# EAGLE design emonGLCD_V1.3 (EAGLE 5.11)
ABBREV: tx1; DRAWING_AUTHOR: Glyn Husdson; PROJECT: EmonTx V1.0
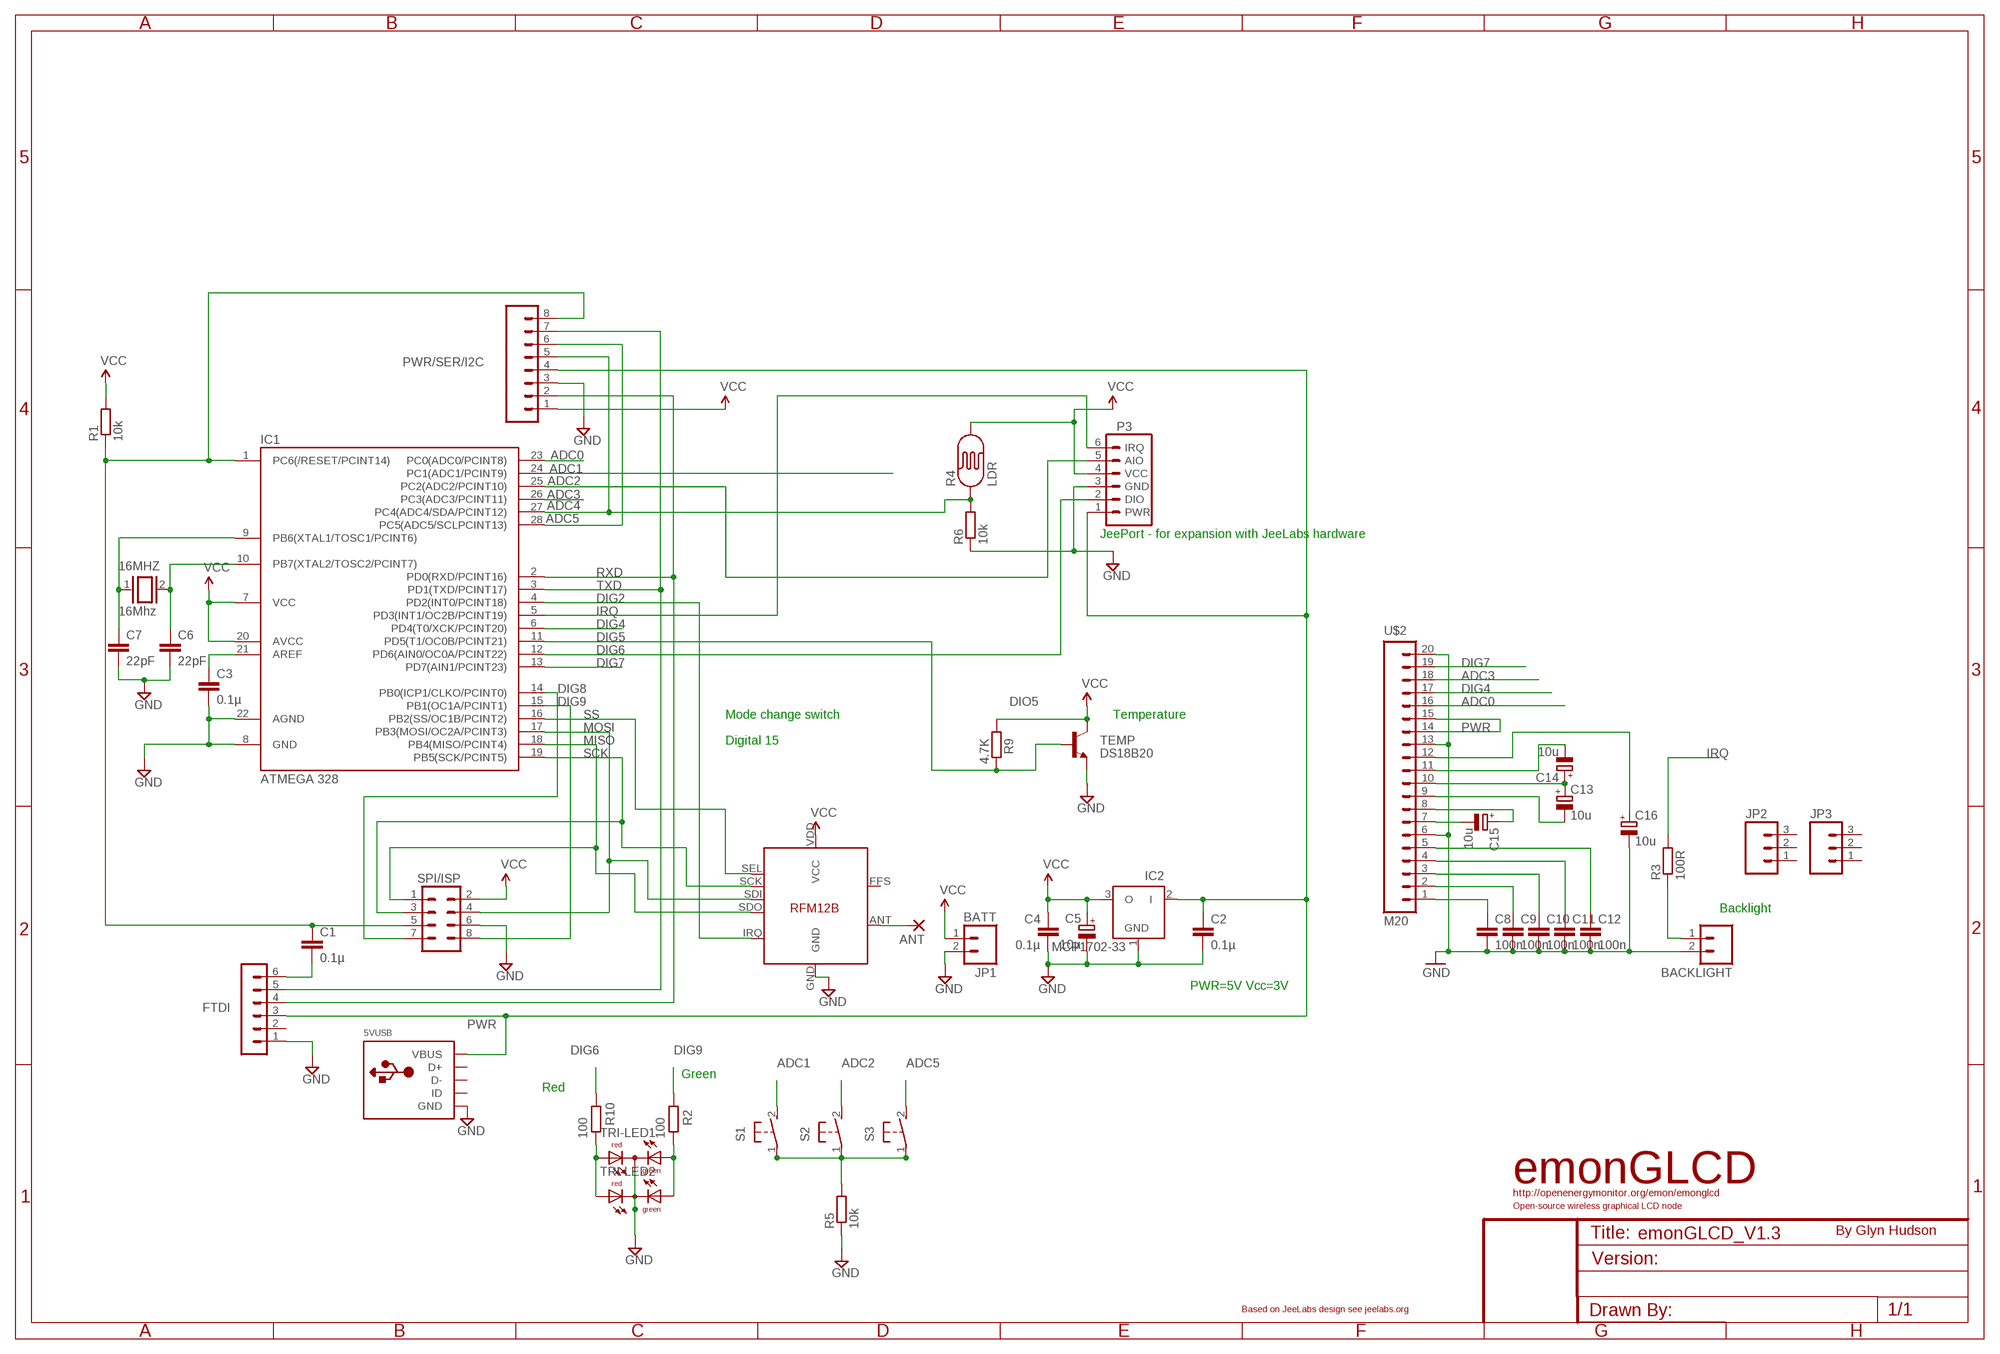
[diagram p0: schematic, sheet 1]

## Parts
5VUSB  USBMOLEX  [USB-MINIB-THM-MOLEX]
16MHZ  16Mhz  XTAL/S  [QS]
ANT  1,6/0,8  [1,6/0,8]
BACKLIGHT  M02PTH  [1X02]
C1  0.1µ  C-EU025-024X044  [C025-024X044]
C2  0.1µ  C-EU025-024X044  [C025-024X044]
C3  0.1µ  C-EU025-024X044  [C025-024X044]
C4  0.1µ  C-EU025-024X044  [C025-024X044]
C5  10µ  CPOL-EUE1.8-4  [E1,8-4]
C6  22pF  C2.5/2  [C2.5-2]
C7  22pF  C2.5/2  [C2.5-2]
C8  100n  C2.5/2  [C2.5-2]
C9  100n  C2.5/2  [C2.5-2]
C10  100n  C2.5/2  [C2.5-2]
C11  100n  C2.5/2  [C2.5-2]
C12  100n  C2.5/2  [C2.5-2]
C13  10u  CPOL-EUE1.8-4  [E1,8-4]
C14  10u  CPOL-EUE1.8-4  [E1,8-4]
C15  10u  CPOL-EUE1.8-4  [E1,8-4]
C16  10u  CPOL-EUE1.8-4  [E1,8-4]
FTDI  FTDI  MA06-1  [MA06-1]
IC1  ATMEGA 328  ATMEGA48/88/168-PU  [DIL28-3]
IC2  MCP1702-33  MCP1702Z  [TO92]
JP1  BATT  M02LOCK_LONGPADS  [1X02_LOCK_LONGPADS]
JP2  M03PTH  [1X03]
JP3  M03PTH  [1X03]
P3  JEEPORT  JEEPORT-LONGPADS  [PORT6PIN]
PWR/SER/I2C  M08  [1X08]
R1  10k  R-EU_0204/7  [0204/7]
R2  100  R-EU_0204/7  [0204/7]
R3  100R  R-EU_0204/7  [0204/7]
R4  LDR  PHOTOCELLPTH  [PHOTOCELL]
R5  10k  R-EU_0204/7  [0204/7]
R6  10k  R-EU_0204/7  [0204/7]
R9  4.7K  R-EU_0204/7  [0204/7]
R10  100  R-EU_0204/7  [0204/7]
S1  31-XX  [B3F-31XX]
S2  31-XX  [B3F-31XX]
S3  31-XX  [B3F-31XX]
SV7  SPI/ISP  MA04-2  [MA04-2]
TEMP  DS18B20  TRANSISTOR_NPNTO92  [TO-92]
TRI-LED1  DUOLED5MM  [DUOLED5MM]
TRI-LED2  DUOLED5MM  [DUOLED5MM]
U$1  RFM12B  [RFM12B]
U$2  M20  [1X20]

## Nets
ADC0: IC1.23(PC0(ADC0/PCINT8)) U$2.16
ADC1: IC1.24(PC1(ADC1/PCINT9)) S1.2(S)
ADC2: IC1.25(PC2(ADC2/PCINT10)) P3.5(AIO) S2.2(S)
ADC3: IC1.26(PC3(ADC3/PCINT11)) U$2.18
ADC4: IC1.27(PC4(ADC4/SDA/PCINT12)) PWR/SER/I2C.5 R4.1 R6.2
ADC5: IC1.28(PC5(ADC5/SCLPCINT13)) PWR/SER/I2C.6 S3.2(S)
DIG2: IC1.4(PD2(INT0/PCINT18)) U$1.IRQ
DIG4 [power]: IC1.6(PD4(T0/XCK/PCINT20)) U$2.17
DIG5: IC1.11(PD5(T1/OC0B/PCINT21)) R9.2 TEMP.2(B)
DIG6: IC1.12(PD6(AIN0/OC0A/PCINT22)) P3.2(DIO) R10.2
DIG7: IC1.13(PD7(AIN1/PCINT23)) U$2.19
DIG8: IC1.14(PB0(ICP1/CLKO/PCINT0)) SV7.7
DIG9: IC1.15(PB1(OC1A/PCINT1)) R2.2 SV7.8
GND [power]: 5VUSB.GND BACKLIGHT.2 C2.2 C3.2 C4.2 C5.- C6.2 C7.2 C8.2 C9.2 C10.2 C11.2 C12.2 C16.- FTDI.1 IC1.8(GND) IC1.22(AGND) IC2.1(GND) JP1.2 P3.3(GND) PWR/SER/I2C.3 R5.1 R6.1 SV7.6 TEMP.1(E) TRI-LED1.K(C) TRI-LED2.K(C) U$1.GND U$2.6 U$2.13 U$2.20
IRQ: IC1.5(PD3(INT1/OC2B/PCINT19)) P3.6(IRQ) R3.2
MISO: IC1.18(PB4(MISO/PCINT4)) SV7.1 U$1.SDO
MOSI: IC1.17(PB3(MOSI/OC2A/PCINT3)) SV7.4 U$1.SDI
N$1: 16MHZ.2 C6.1 IC1.10(PB7(XTAL2/TOSC2/PCINT7))
N$2: C8.1 U$2.1
N$3: C9.1 U$2.2
N$4: R5.2 S1.1(P) S2.1(P) S3.1(P)
N$5: C10.1 U$2.3
N$6: C11.1 U$2.4
N$7: C12.1 U$2.5
N$8: R10.1 TRI-LED1.AR TRI-LED2.AR
N$12: 16MHZ.1 C7.1 IC1.9(PB6(XTAL1/TOSC1/PCINT6))
N$13: ANT.1(P) U$1.ANT
N$14: R2.1 TRI-LED1.AG TRI-LED2.AG
N$15: C1.2 FTDI.6
N$17: BACKLIGHT.1 R3.1
N$19: C3.1 IC1.21(AREF)
N$20: C14.- U$2.11
N$21: C13.+ C14.+ U$2.10
N$22: C13.- U$2.9
N$23: C15.- U$2.7
N$27: C15.+ U$2.8
N$28: C16.+ U$2.12
PWR [power]: 5VUSB.VBUS C2.1 FTDI.3 IC2.2(I) P3.1(PWR) PWR/SER/I2C.4 U$2.14 U$2.15
RST: C1.1 IC1.1(PC6(/RESET/PCINT14)) PWR/SER/I2C.8 R1.1 SV7.5
RXD: FTDI.4 IC1.2(PD0(RXD/PCINT16)) PWR/SER/I2C.2
SCK: IC1.19(PB5(SCK/PCINT5)) SV7.3 U$1.SCK
SS: IC1.16(PB2(SS/OC1B/PCINT2)) U$1.SEL
TXD: FTDI.5 IC1.3(PD1(TXD/PCINT17)) PWR/SER/I2C.7
VCC [power]: C4.1 C5.+ IC1.7(VCC) IC1.20(AVCC) IC2.3(O) JP1.1 P3.4(VCC) PWR/SER/I2C.1 R1.2 R4.2 R9.1 SV7.2 TEMP.3(C) U$1.VDD(VCC)
Unconnected: 5VUSB.D+ 5VUSB.D- 5VUSB.ID FTDI.2 JP2.1 JP2.2 JP2.3 JP3.1 JP3.2 JP3.3 U$1.FFS

## Notes on the sheet
- JeePort - for expansion with JeeLabs hardware
- DIO5
- Mode change switch | Temperature
- Digital 15
- Backlight
- PWR=5V Vcc=3V
- Green
- Red
- emonGLCD
- http://openenergymonitor.org/emon/emonglcd
- Open-source wireless graphical LCD node
- By Glyn Hudson
- Based on JeeLabs design see jeelabs.org

## Library data of the parts
5VUSB = adafruit:USB: USB Connectors USBMINIB - Surface Mount Female Mini-B USB Connector 4UConnector: 06564 By microbuilder.eu Thru-hole RA Female Mini-B USB Connector 4UConnector: 18732 By ladyada.net
16MHZ = special:XTAL/S: CRYSTAL
ANT = JeeLabs:1,6/0,8: THROUGH-HOLE PAD
BACKLIGHT JP1 = SparkFun:M02: Header 2 Standard 2-pin 0.1" header. Use with straight break away headers (SKU : PRT-00116), right angle break away headers (PRT-00553), swiss pins (PRT-00743), machine pins (PRT-00117), and female headers (PRT-00115). Molex polarized connector foot print use with SKU : PRT-08233 with associated crimp pins and housings.
C1-C4 = resistor:C-EU: CAPACITOR, European symbol
C5 C13-C16 = resistor:CPOL-EU: POLARIZED CAPACITOR, European symbol
C6-C12 = capacitor-wima:C: CAPACITOR naming: grid - package width
FTDI = JeeLabs:MA06-1: PIN HEADER
IC1 = atmega8:ATMEGA48/88/168-PU
IC2 = JeeLabs:MCP1702: 200 mA, Low Power Low Dropout Voltage Regulator
JP2 JP3 = SparkFun:M03: Header 3 Standard 3-pin 0.1" header. Use with straight break away headers (SKU : PRT-00116), right angle break away headers (PRT-00553), swiss pins (PRT-00743), machine pins (PRT-00117), and female headers (PRT-00115). Molex polarized connector foot print use with SKU : PRT-08232 with associated crimp pins and housings.
P3 = JeeParts:JEEPORT: PIN HEADER
PWR/SER/I2C = SparkFun:M08: Header 8 Standard 8-pin 0.1" header. Use with straight break away headers (SKU : PRT-00116), right angle break away headers (PRT-00553), swiss pins (PRT-00743), machine pins (PRT-00117), and female headers (PRT-00115).
R1 R5 R6 = resistor:R-EU_: RESISTOR, European symbol
R2 R3 R9 R10 = rcl:R-EU_: RESISTOR, European symbol
R4 = SparkFun:PHOTOCELL: Photocell Also known as a CdS photoresistor. This is a low cost way to detect light levels. Resistance decreases with more incoming light. SparkFun SKU: SEN-09088
S1-S3 = switch-omron:31-XX: OMRON SWITCH
SV7 = JeeLabs:MA04-2: PIN HEADER
TEMP = SparkFun:TRANSISTOR_NPN: Transistor NPN BJT configuration in SOT23 package. MMBT2222 is the common NPN we use. Double check BCE configuration again layout.
TRI-LED1 TRI-LED2 = led:DUOLED5MM: DUO LED 2 colors, 5 mm, round
U$1 = JeeLabs:RFM12B
U$2 = SparkFun:M20: This is just like the LOCK variant in that the holes are staggared by 5 mil, but except for the last two holes. They are not altered from the "standard" footprint layout. This is used for a special purpose on the layout of our Graphic LCD Backpack. Make sure you want to use this device before selecting it for you project!

## Net classes
0 default: width 0.254 mm, drill 0.6 mm, clearance 0.254 mm
1 power: width 0.305 mm, drill 0.6 mm, clearance 0.254 mm

## Board
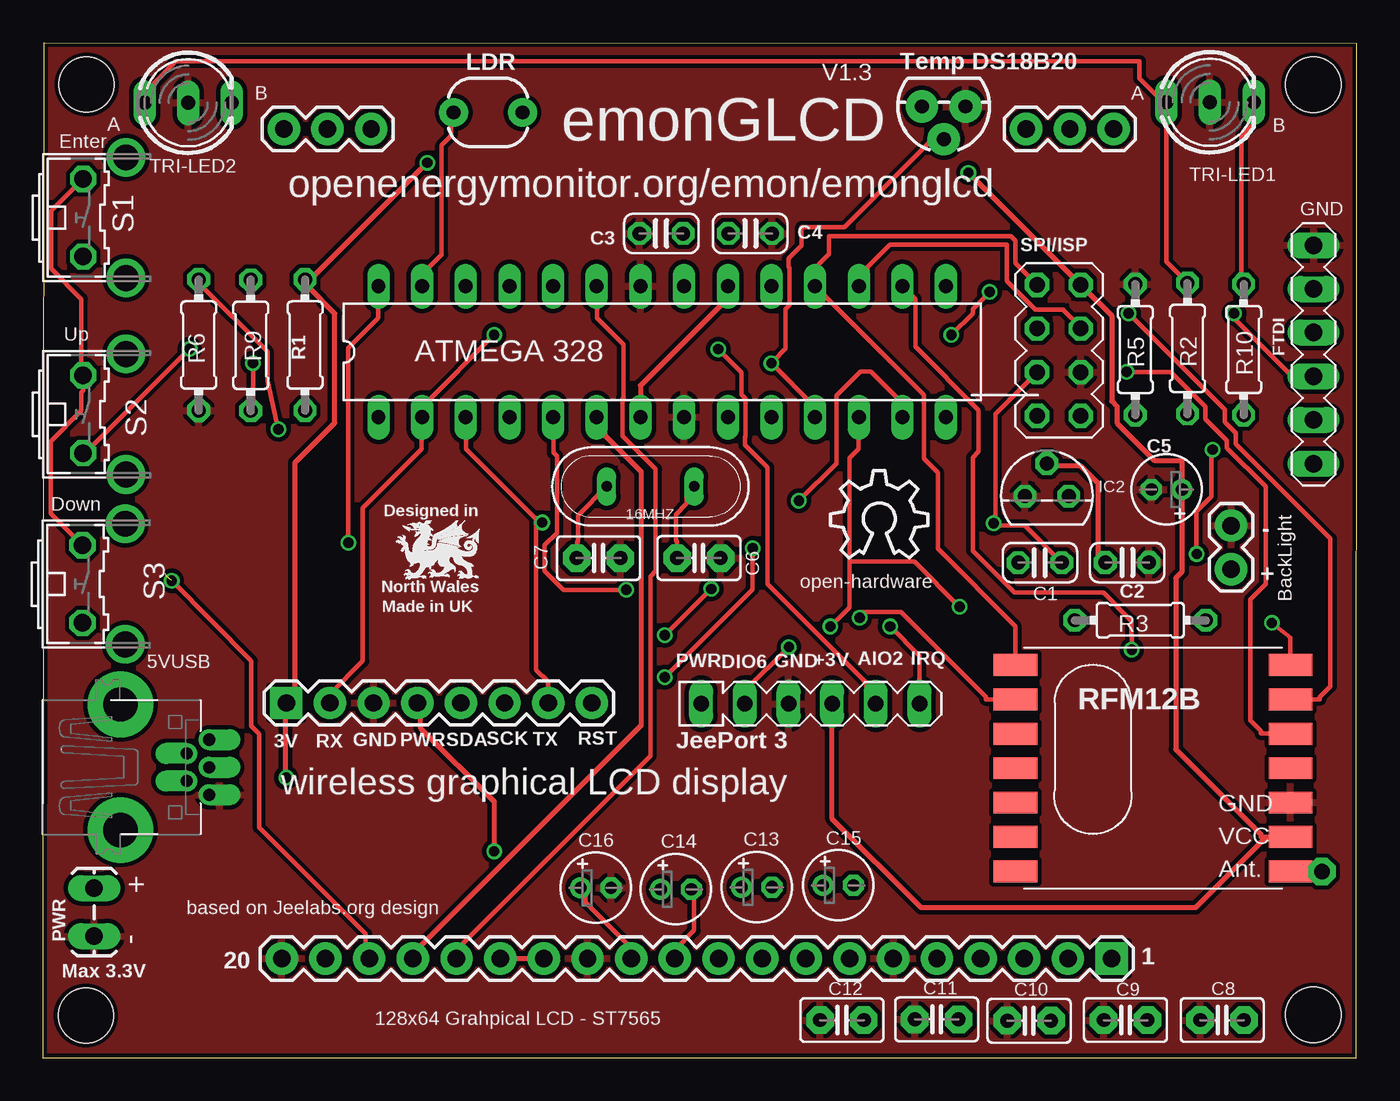
[diagram p1: board, top side]
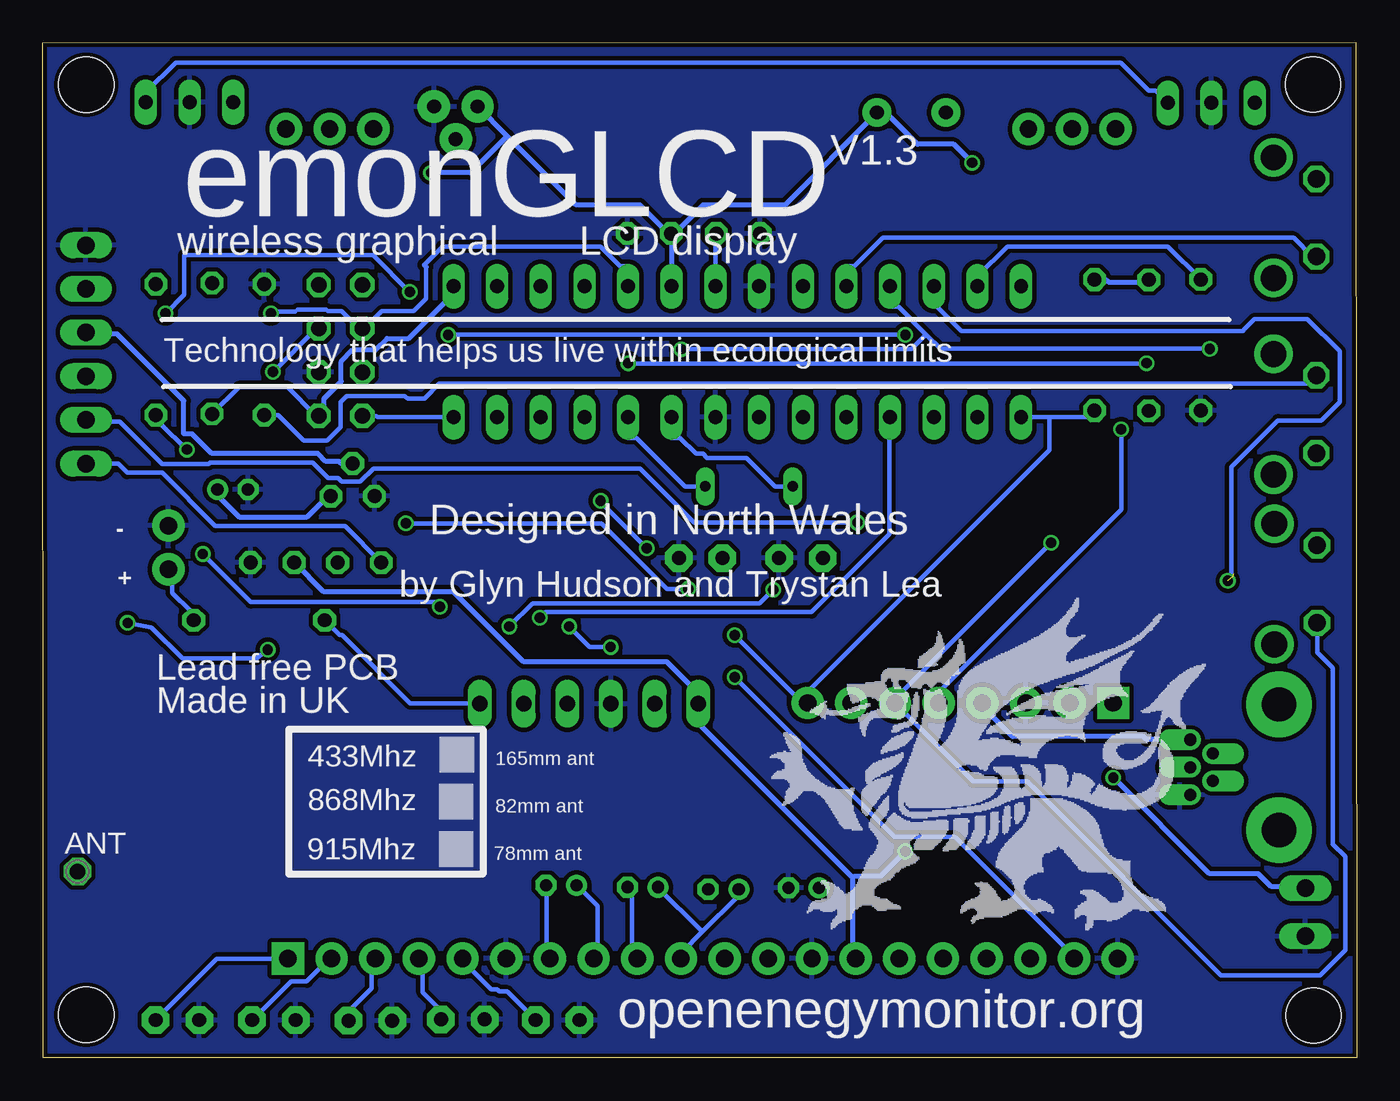
[diagram p2: board, bottom side, seen from below]

Size 76.4 x 59.04 mm. Coordinates in mm from the lower left corner, seen from the top.
Outline: 0.03,59.04 76.4,59.03 76.38,0 0,0 0.03,59.04
Copper layers (1*16): Top 0.035mm / dielectric 1.5mm / Bottom 0.035mm
Design rules "Fusion_eagle_rule_v1.1 *": minimum track width 0.2mm, minimum drill 0.6mm, track to track 0.2mm, track to pad 0.2mm, pad to pad 0.2mm, via to via 0.2mm, smd to smd 0.2mm, copper to edge 10mil, drill to drill 0.2mm, minimum pad ring 10mil, minimum via ring 6mil, stop-mask expansion 0.125mm, vias tented up to drill 25mil, thermal gap 10mil
Holes 3.2 mm at 2.54,56.62 73.89,56.61 73.88,2.51 2.49,2.47

### Footprints (pad centres in the part's own frame; a part is rotated, then mirrored left to right if it is on the bottom)
USB-MINIB-THM-MOLEX = drill 0.7 offset: D+ 0,9.72; D- -0.8,8.42; GND 1.6,9.72; ID 0.8,8.42; VBUS -1.6,9.72 | drill 2 pad 3.81 round: GND1 -3.65,4.57; GND4 3.65,4.57
QS = drill 0.61 long: 1 -2.54,0; 2 2.54,0
1,6/0,8 = drill 0.9 pad 1.6 octagon: 1 0,0
1X02 = drill 1.016 pad 1.88 round: 1 0,0; 2 2.54,0
C025-024X044 = drill 0.813 octagon: 1 -1.27,0; 2 1.27,0
E1,8-4 = drill 0.711 pad 1.168 round: + -0.889,0 | drill 0.711 pad 1.168 octagon: - 0.889,0
C2.5-2 = drill 0.813 pad 1.6 octagon: 1 -1.27,0; 2 1.27,0
MA06-1 = drill 1.016 long: 1 0,0; 2 2.54,0; 3 5.08,0; 4 7.62,0; 5 10.16,0; 6 12.7,0
DIL28-3 = drill 0.813 long: 1 -16.51,-3.81; 2 -13.97,-3.81; 3 -11.43,-3.81; 4 -8.89,-3.81; 5 -6.35,-3.81; 6 -3.81,-3.81; 7 -1.27,-3.81; 8 1.27,-3.81; 9 3.81,-3.81; 10 6.35,-3.81; 11 8.89,-3.81; 12 11.43,-3.81; 13 13.97,-3.81; 14 16.51,-3.81; 15 16.51,3.81; 16 13.97,3.81; 17 11.43,3.81; 18 8.89,3.81; 19 6.35,3.81; 20 3.81,3.81; 21 1.27,3.81; 22 -1.27,3.81; 23 -3.81,3.81; 24 -6.35,3.81; 25 -8.89,3.81; 26 -11.43,3.81; 27 -13.97,3.81; 28 -16.51,3.81
TO92 = drill 0.813 octagon: 1 -1.27,0; 2 0,1.905; 3 1.27,0
1X02_LOCK_LONGPADS = drill 1.016 long: 1 -0.127,0; 2 2.667,0
1X03 = drill 1.016 pad 1.88 round: 1 0,0; 2 2.54,0; 3 5.08,0
PORT6PIN = drill 0.9 long: 1 -6.35,0; 2 -3.81,0; 3 -1.27,0; 4 1.27,0; 5 3.81,0; 6 6.35,0
1X08 = drill 1.016 pad 1.88 square: 1 0,0 | drill 1.016 pad 1.88 round: 2 2.54,0; 3 5.08,0; 4 7.62,0; 5 10.16,0; 6 12.7,0; 7 15.24,0; 8 17.78,0
0204/7 = drill 0.813 octagon: 1 -3.81,0; 2 3.81,0
PHOTOCELL = drill 0.8 pad 1.676 round: 1 -2,0; 2 2,0
B3F-31XX = drill 1.016 octagon: 1 -2.261,-1.245; 2 2.261,-1.245 | drill 1.499 pad 2.159 round: 3 -3.505,1.245; 4 3.505,1.245
MA04-2 = drill 0.9 octagon: 1 -3.81,-1.27; 2 -3.81,1.27; 3 -1.27,-1.27; 4 -1.27,1.27; 5 1.27,-1.27; 6 1.27,1.27; 7 3.81,-1.27; 8 3.81,1.27
TO-92 = drill 0.813 pad 1.88 round: 1 -1.27,0; 2 0,1.905; 3 1.27,0
DUOLED5MM = drill 0.813 long: AG -2.54,0; AR 2.54,0; K 0,0
RFM12B = smd 2.54 x 1.27: ANT 8,-6; FFS -8,2; GND 8,-2; IRQ -8,4; P$8 -8,0; P$9 -8,-2; P$10 -8,-4; P$12 -8,-6; P$16 8,0; SCK 8,4; SDI 8,2; SDO -8,6; SEL 8,6; VDD 8,-4
1X20 = drill 1.016 pad 1.88 square: 1 0,0 | drill 1.016 pad 1.88 round: 2 2.54,0; 3 5.08,0; 4 7.62,0; 5 10.16,0; 6 12.7,0; 7 15.24,0; 8 17.78,0; 9 20.32,0; 10 22.86,0; 11 25.4,0; 12 27.94,0; 13 30.48,0; 14 33.02,0; 15 35.56,0; 16 38.1,0; 17 40.64,0; 18 43.18,0; 19 45.72,0; 20 48.26,0

### Placement (x,y rotation side)
5VUSB  -0.06,16.92 270 top
16MHZ  35.33,33.24 0 top
ANT  74.38,10.85 0 bottom
BACKLIGHT  69.1,28.43 90 top
C1  57.99,28.81 180 top
C2  63.05,28.82 0 top
C3  35.97,47.96 180 top
C4  41.13,47.96 0 top
C5  65.36,33.07 180 top
C6  38.15,29.08 0 top
C7  32.31,29.08 0 top
C8  68.58,2.21 180 top
C9  62.96,2.21 180 top
C10  57.35,2.17 180 top
C11  51.98,2.25 180 top
C12  46.47,2.21 180 top
C13  41.51,9.94 0 top
C14  36.82,9.82 0 top
C15  46.25,10.05 0 top
C16  32.15,9.9 0 top
FTDI  73.9,47.28 270 top
IC1  36.02,41.08 0 top
IC2  58.39,32.67 0 top
JP1  2.98,9.75 270 top
JP2  57.18,54.04 0 top
JP3  14.01,54.04 0 top
P3  44.63,20.61 0 top
PWR/SER/I2C  14.15,20.65 0 top
R1  15.24,41.47 90 top
R2  66.57,41.27 270 top
R3  63.82,25.46 180 top
R4  25.89,54.99 0 top
R5  63.53,41.21 270 top
R6  9.05,41.47 90 top
R9  12.08,41.45 270 top
R10  69.83,41.2 270 top
S1  3.58,48.87 270 top
S2  3.58,37.44 270 top
S3  3.54,27.57 270 top
SV7  59.09,41.16 270 top
TEMP  52.39,55.35 180 top
TRI-LED1  67.87,55.59 0 top
TRI-LED2  8.44,55.56 0 top
U$1  64.56,16.85 0 top
U$2  62.15,5.79 180 top
U$3  Open-source Hardware  [OSHW_8X200_NOTEXT]  45.8,29.08 0 top

### Tracks (layer width: path | path; a pad name or v marks a point on that pad's centre or on a via)
ADC0
  Top 0.254: IC1.23 32.23,44.86 32.23,43.03 33.76,41.51 33.76,38.41 33.7,38.36 33.7,36.17 35.64,34.24 35.64,28.33 35.33,28.02 35.33,17.58 24.05,6.3 24.05,5.8 U$2.16
ADC1
  Bottom 0.254: IC1.24 29.67,46.06 29.21,46.06 27.56,47.71 3.66,47.71 2.56,46.61 S1.2
ADC2  (via drill 0.6)
  Top 0.254: v8.53,41.25 2.46,35.18 S2.2 | v39.27,41.23 40.64,39.86 40.64,38.59 40.87,38.36 40.87,36.17 40.82,36.12 40.82,35.67 42.14,34.35 42.14,27.56 47.88,21.82 47.88,21.19 48.44,20.63 P3.5
  Bottom 0.254: IC1.25 27.13,43.69 26.64,43.69 25.03,42.08 | 25.03,42.08 24.21,41.25 v8.53,41.25 | v39.27,41.23 25.88,41.23 25.03,42.08
ADC3  (via drill 0.6)  (2 unrouted)
  Top 0.254: v7.49,27.76 12.11,23.09 12.11,19.31 12.57,18.85 12.57,13.42 18.77,7.22 18.77,5.97 18.95,5.8 U$2.18
  Bottom 0.254: IC1.26 24.59,43.89 22.97,42.28 6.6,42.28 6.55,42.33 6.55,42.36 5.93,42.98 2.85,42.98 0.99,41.11 0.99,38.14 2.04,37.09 4.57,37.09 7.3,34.37 7.3,28.13 v7.49,27.76
ADC4  (via drill 0.6)
  Top 0.254: IC1.27 22.05,45.6 23.19,46.74 23.19,53.09 23.75,53.65 23.75,54.84 23.88,54.97 R4.1 | v13.69,36.57 13.05,39.37 13.05,41.08 9.07,45.06 9.07,45.27 R6.2
  Bottom 0.254: IC1.27 22.05,45.47 20.32,47.2 10.97,47.2 9.07,45.29 R6.2 | v13.69,36.57 13.69,31.91 24.15,21.44 24.28,21.44 24.28,20.66 PWR/SER/I2C.5
ADC5  (via drill 0.6)
  Top 0.254: IC1.28 19.48,44.86 19.48,43.03 17.75,41.31 v17.75,29.98
  Bottom 0.254: v17.75,29.98 26.82,20.91 26.82,20.66 PWR/SER/I2C.6 22.28,16.08 19.15,16.08 7.88,4.82 2.11,4.82 0.66,6.27 0.66,11.72 1.37,12.43 1.37,22.68 2.29,23.6 S3.2
DIG2  (via drill 0.6)
  Top 0.254: v47.5,25.61 47.5,25.94 49.91,25.94 54.84,21.01 54.84,20.86 56.54,20.86 U$1.IRQ
  Bottom 0.254: v47.5,25.61 47.17,25.94 31.7,25.94 27.15,30.48 27.15,37.27 IC1.4
DIG4
  Top 0.305: IC1.6 32.69,36.78 32.69,36.2 34.8,34.09 34.8,19.36 21.51,6.08 21.51,5.8 U$2.17
DIG5  (via drill 0.6)
  Top 0.254: v12.22,40.42 12.22,37.77 R9.2 | IC1.11 44.91,37.88 v42.37,40.42 42.44,40.52 43.18,41.25 43.18,43.57 43.41,43.79 43.41,45.98 43.36,46.03 43.36,46.49 44.12,47.25 44.12,48.32 46.61,48.32 51.59,53.29 51.59,53.42 52.37,53.42 TEMP.2
  Bottom 0.254: v12.22,40.42 12.24,40.39 42.34,40.39 v42.37,40.42
DIG6  (via drill 0.6)
  Top 0.254: IC1.12 47.42,37.24 47.42,35.41 46.91,34.9 46.91,28.88 | 46.91,28.88 46.91,26.22 v45.8,25.1 | v43.38,23.91 40.84,21.37 40.84,20.63 P3.2 | v68.02,35.39 67.94,35.31 67.94,32.64 67.08,31.78 67.08,29.34 v67.11,29.32 | v53.31,26.24 50.67,28.88 46.91,28.88
  Bottom 0.254: v45.8,25.1 44.6,23.91 v43.38,23.91 | v68.02,35.39 68.05,35.39 69.54,36.89 69.82,36.89 69.82,37.39 R10.2 | v67.11,29.32 64.31,26.52 53.59,26.52 v53.31,26.24
DIG7  (via drill 0.6)
  Top 0.254: IC1.13 49.96,37.24 49.96,38.12 48.14,39.94 47.55,39.94 46.14,38.53 46.14,34.59 v43.96,32.42 | v41.27,29.65 41.27,27.26 v36.17,22.15
  Bottom 0.254: v36.17,22.15 26.87,12.86 23.37,12.86 16.43,5.92 16.43,5.8 U$2.19 | v43.96,32.42 43.96,32.34 v41.27,29.65
DIG8
  Bottom 0.254: IC1.14 56.95,37.27 57.02,37.34 57.81,37.34 SV7.7
DIG9
  Bottom 0.254: R2.2 66.55,37.47 65,39.02 62.18,39.02 60.55,37.39 60.48,37.39 SV7.8
  Bottom 0.305: IC1.15 52.53,44.46 55.13,41.85 56.39,41.85 57.05,41.19 58.38,41.19 59.05,40.52 59.05,39.35 60.05,38.35 60.05,37.66 SV7.8
GND
  pour Bottom (isolate 0.254): 78.7,61.1 78.53,-1.57 -2.22,-1.73 -2.03,60.94
  pour Top: -3.21,62.8 80.29,62.8 80.29,-3.1 -3.21,-3.1
IRQ  (via drill 0.6)
  Top 0.254: IC1.5 29.69,37.24 29.69,35.21 29.89,35.01 29.89,30.54 29.18,29.82 29.18,28.33 30.28,27.23 v33.93,27.23 | v49.28,25.1 50.98,23.4 50.98,20.63 P3.6
  Bottom 0.254: v33.93,27.23 34.72,26.45 47.93,26.45 v49.28,25.1 | R3.2 59.99,25.46 59.13,24.59 59,24.59 55.04,20.63 51,20.63 P3.6
MISO
  Top 0.254: SV7.1 57.81,44.99 56.56,46.23 56.56,47.53 56.29,47.81 45.72,47.81 45.72,46.77 44.98,46.03 44.98,44.99 IC1.18 51.25,38.55 51.25,34.85 52.05,34.06 52.05,29.62 56.56,25.11 U$1.SDO
MOSI  (via drill 0.6)
  Top 0.254: v63.02,39.91 65.61,39.91 67.61,37.9 67.61,37.17 68.86,35.92 68.86,35.49 71.12,33.23 71.12,27.56 70.23,26.67 70.23,19.64 70.84,19.03 70.84,18.88 72.54,18.88 U$1.SDI | IC1.17 47.95,45.39 47.95,46 49.25,47.3 56.06,47.3 56.06,45.19 57.71,43.54 59.36,43.54 59.36,43.49 60.35,42.5 60.35,42.45 SV7.4
  Bottom 0.254: v63.02,39.91 60.5,42.42 60.37,42.42 SV7.4
N$1
  Top 0.254: 16MHZ.2 37.87,33.23 37.44,32.8 37.44,32.24 36.8,31.6 36.8,30.1 36.88,30.03 C6.1
  Bottom 0.254: IC1.10 42.37,36.07 41.88,36.07 39.06,33.25 16MHZ.2
N$2
  Bottom 0.254: C8.1 66.29,5.77 62.15,5.77 U$2.1
N$3
  Bottom 0.254: C9.1 64.21,2.21 61.98,4.45 61.06,4.45 59.74,5.77 59.61,5.77 U$2.2
N$4
  Top 0.254: S3.1 2.29,29.85 0.46,31.68 0.46,35.87 2.23,37.65 2.23,38.71 2.34,38.82 S2.1 2.23,39.78 2.23,44.15 0.48,45.9 0.48,49.28 S1.1
  Bottom 0.254: R5.2 62.71,37.4 61.24,35.92 59.87,35.92 59.1,36.7 59.1,38.15 58.74,38.51 55.36,38.51 55.19,38.34 54.21,38.34 54.19,38.37 53.36,39.22 2.82,39.22 S2.1
N$5
  Bottom 0.254: C10.1 58.62,2.19 58.62,2.82 58.5,2.82 57.28,4.04 57.28,5.77 57.07,5.77 U$2.3
N$6
  Bottom 0.254: C11.1 53.26,2.27 53.26,2.9 53.39,2.9 54.3,3.81 54.3,5.77 54.51,5.77 U$2.4
N$7
  Bottom 0.254: C12.1 47.75,2.21 49.4,3.87 49.86,3.87 49.99,3.99 50.34,3.99 51.97,5.62 51.97,5.77 U$2.5
N$8
  Top 0.254: R10.1 69.82,45.04 69.7,45.17 69.7,53.62 70.41,54.34 70.41,55.58 TRI-LED1.AR
  Bottom 0.254: TRI-LED2.AR 11,55.58 11.68,56.27 12.09,56.27 13.72,57.89 68.68,57.89 70.41,56.16 TRI-LED1.AR
N$12
  Top 0.254: 16MHZ.1 32.79,33.23 31.11,31.55 31.11,30.05 31.06,30 31.06,29.09 C7.1
  Bottom 0.254: IC1.9 39.83,36.07 39.34,36.07 38.43,35.16 38.02,35.16 37.77,34.9 35.48,34.9 33.83,33.25 16MHZ.1
N$13
  Top 0.254: 72.57,10.85 U$1.ANT | ANT.1
  Top 0.61: ANT.1 72.57,10.85
N$14
  Top 0.254: TRI-LED2.AG 5.92,55.58 6.43,56.09 6.43,56.67 7.72,57.97 63.78,57.97 63.78,56.98 65.15,55.61 TRI-LED1.AG 65.33,55.48 65.33,46.31 66.55,45.09 R2.1
N$15
  Bottom 0.254: C1.2 56.72,28.83 58.83,30.94 66.37,30.94 69.47,34.04 71.5,34.04 72.03,34.57 FTDI.6
N$17
  Bottom 0.254: R3.1 67.64,25.48 67.64,25.99 67.82,25.99 68.88,27.06 68.88,28.43 69.09,28.43 BACKLIGHT.1
N$19
  Bottom 0.254: IC1.21 37.29,47.96 C3.1
N$20
  Top 0.254: C14.- 37.72,9.81 37.87,9.66 37.87,7.42 36.75,6.3 36.75,5.8 U$2.11
N$21
  Bottom 0.254: 38.04,7.36 39.27,6.13 39.27,5.8 U$2.10 | 38.04,7.36 36.04,9.35 35.94,9.35 35.94,9.81 C14.+ | C13.+ 40.61,9.91 38.15,7.45 38.12,7.45 38.04,7.36
N$22
  Bottom 0.254: C13.- 42.39,9.91 42.39,9.45 42.26,9.45 42.14,9.33 42.14,5.8 41.83,5.8 U$2.9
N$23
  Bottom 0.254: C15.- 47.12,10.04 47.12,5.8 46.91,5.8 U$2.7
N$27
  Bottom 0.254: C15.+ 45.34,10.04 44.14,8.84 44.14,5.8 44.35,5.8 U$2.8
N$28
  Top 0.254: C16.+ 31.27,9.89 31.55,9.61 31.55,9.05 34.19,6.41 34.19,5.8 U$2.12
PWR  (via drill 0.6)
  Top 0.305: C2.1 61.77,28.83 61.39,29.21 61.39,33.41 60.37,34.42 58.39,34.42 IC2.2 | U$2.15 26.59,5.77 29.11,5.77 U$2.14 | v26.24,12.02 26.24,14.91 21.94,19.21 21.94,20.45 21.77,20.63 PWR/SER/I2C.4
  Bottom 0.305: FTDI.3 73.81,42.12 72.08,42.12 68.2,38.23 68.2,36.3 67.72,36.3 66.57,35.16 60.4,35.16 59.94,34.7 59.18,34.7 59.08,34.6 58.39,34.6 IC2.2 | 5VUSB.VBUS 9.68,18.52 12.22,18.52 12.39,18.7 20.01,18.7 21.74,20.43 21.74,20.63 PWR/SER/I2C.4 | 29.31,10.5 38.18,19.36 38.28,19.36 P3.1 38.3,20.76 38.3,21.24 40.11,23.04 48.44,23.04 52.5,27.11 60.07,27.11 61.77,28.81 C2.1 | 29.31,10.5 29.31,5.8 29.13,5.8 U$2.14 | v26.24,12.02 27.69,10.57 29.18,10.57 29.31,10.5
RST  (via drill 0.6)
  Top 0.254: 55.4,31.09 55.4,37.44 57.81,39.86 57.81,39.88 SV7.5 | 55.4,31.09 55.4,30.97 57.1,30.97 59.23,28.83 C1.1 | v36.17,24.59 v38.86,27.28 | v55.29,31.09 55.4,31.09
  Bottom 0.254: 17.86,37.27 IC1.1 | 17.86,37.27 15.62,37.27 15.24,37.65 R1.1 | 17.86,37.27 17.86,35.36 31.77,21.44 31.9,21.44 31.9,20.66 PWR/SER/I2C.8 32,21.09 32.66,21.09 v36.17,24.59 | v55.29,31.09 43.92,31.09 40.11,27.28 v38.86,27.28
RXD  (via drill 0.6)
  Top 0.254: PWR/SER/I2C.2 16.69,21.19 18.59,23.09 18.59,31.98 22.02,35.41 22.02,37.24 IC1.2 22.12,37.37 22.12,37.95 v26.24,42.07 | v69.26,43.31 69.26,43.03 72.52,39.78 72.52,39.68 73.89,39.68 FTDI.4 | v55.07,44.56 54.08,43.57 54.08,43.31 v52.83,42.07
  Bottom 0.254: v69.26,43.31 68.17,44.4 68.17,46.69 57.2,46.69 v55.07,44.56 | v26.24,42.07 v52.83,42.07
SCK  (via drill 0.6)
  Top 0.254: v63.14,43.31 68.73,37.72 68.73,36.99 69.37,36.35 69.37,35.72 74.88,30.21 74.88,21.62 74.27,21.01 74.27,20.86 72.57,20.86 U$1.SCK
  Bottom 0.254: v63.14,43.31 63.04,43.41 61.72,43.41 61.59,43.54 59.92,43.54 59.82,43.44 59.03,43.44 58.04,42.45 57.83,42.45 SV7.3 57.71,42.47 57.66,42.47 56.69,43.44 54.84,43.44 54.11,44.16 54.11,46.02 | IC1.19 42.37,46.06 42.82,46.06 43.97,47.2 53.16,47.2 54.23,46.13
  Bottom 0.305: 54.23,46.13 54.11,46.02
SS  (via drill 0.6)
  Top 0.254: U$1.SEL 72.55,24.45 v71.47,25.31 | v63.33,23.76 63.31,25.42 61.66,27.07 56.5,27.07 54.08,29.49 54.08,34.93 54.42,35.27 54.42,37.69 50.73,41.38 50.73,44.14 IC1.16
  Bottom 0.254: v71.47,25.31 70.09,25.03 68.28,23.23 63.98,23.23 v63.33,23.76
TXD  (via drill 0.6)
  Top 0.254: IC1.3 24.61,37.24 24.61,35.41 28.68,31.35 28.68,31.15 | 28.68,31.15 28.68,22.59 29.36,21.9 29.36,20.66 PWR/SER/I2C.7 | 28.68,31.15 v29.03,31.15
  Bottom 0.254: v29.03,31.15 38.53,31.15 41.68,34.29 57.17,34.29 57.94,33.53 59.03,33.53 59.23,33.74 59.82,33.74 60.71,34.63 66.67,34.63 66.75,34.55 69.47,34.55 71.93,37.01 73.79,37.01 FTDI.5
VCC  (via drill 0.6)
  Top 0.305: 71.14,12.86 70.84,12.86 70.84,13.01 65.89,17.96 65.89,27.92 66.24,28.28 66.24,33.05 C5.+ 66.24,33.23 66.24,34.75 64.64,34.75 62.46,36.94 62.46,37.9 62.15,38.21 62.15,43.18 60.37,44.96 SV7.2 60.25,45.06 v53.82,51.49 | 71.14,12.86 72.54,12.86 U$1.VDD | v14.15,16.31 14.12,16.34 14.12,20.63 PWR/SER/I2C.1 14.22,20.78 14.65,21.21 14.65,34.63 16.97,36.94 16.97,43.31 15.47,44.81 15.47,45.17 R1.2 15.72,45.29 15.72,45.45 v22.35,52.07 | IC1.7 34.75,39.12 39.83,44.2 IC1.20 | P3.4 45.9,13.92 51.08,8.74 67.03,8.74 71.14,12.86
  Bottom 0.305: C5.+ 66.24,33.05 66.24,32.62 66.14,32.62 65,31.48 61.04,31.48 59.84,32.67 IC2.3 | v14.15,16.31 8.56,10.72 5.71,10.72 4.95,9.96 3.07,9.96 3,9.89 JP1.1 | R9.1 12.09,45.24 12.19,45.14 14.43,45.14 14.55,45.27 15.24,45.27 R1.2 | IC1.20 39.85,44.89 C4.1 | C4.1 39.7,47.99 39.65,47.99 38.02,49.61 33.25,49.61 27.89,54.97 R4.2 27.76,54.89 27.28,54.89 25.53,53.14 23.42,53.14 v22.35,52.07 | 49.4,53.62 45.39,49.61 41.68,49.61 40.08,48.01 40,48.01 C4.1 | 49.4,53.62 51.1,55.33 TEMP.3 | v53.82,51.49 51.54,51.49 49.4,53.62

### Text on the board
_tsilk: LDR | Temp DS18B20 | B | V1.3 | A | A | B | Enter | emonGLCD | openenergymonitor.org/emon/emonglcd | GND | C3 | C4 | SPI/ISP | Up | R1 | FTDI | C5 | Down | Designed in | - | + | North Wales | open-hardware | C2 | BackLight | Made in UK | PWR | DIO6 | GND | +3V | AIO2 | IRQ | RFM12B | 3V | RX | GND | PWR | SDA | SCK | TX | RST | JeePort 3 | wireless graphical LCD display | + | PWR | based on Jeelabs.org design | - | Max 3.3V | 1 | 20 | 128x64 Grahpical LCD - ST7565
_bsilk: V1.3 | emonGLCD | wireless graphical LCD display | Technology that helps us live within ecological limits | Designed in North Wales | - | + | by Glyn Hudson and Trystan Lea | Lead free PCB | Made in UK | 165mm ant | 433Mhz | 868Mhz | 82mm ant | 78mm ant | 915Mhz | openenegymonitor.org